# Altium schematic sheet Mosaic.SchDoc: Title of General Schematic Template
size 558 x 426 mm; Date: 10/21/2018; CompanyName: Facebook Inc.; DrawnBy: Xu Li; Engineer: Xu Li; Organization: Facebook Connectivity RF / Hardware; Address1: 1 Hacker Way; Address2: MPK10.02N; Address3: Menlo Park, CA 94025; Address4: USA; DocumentNumber: 0; Revision: 0; SheetNumber: 0
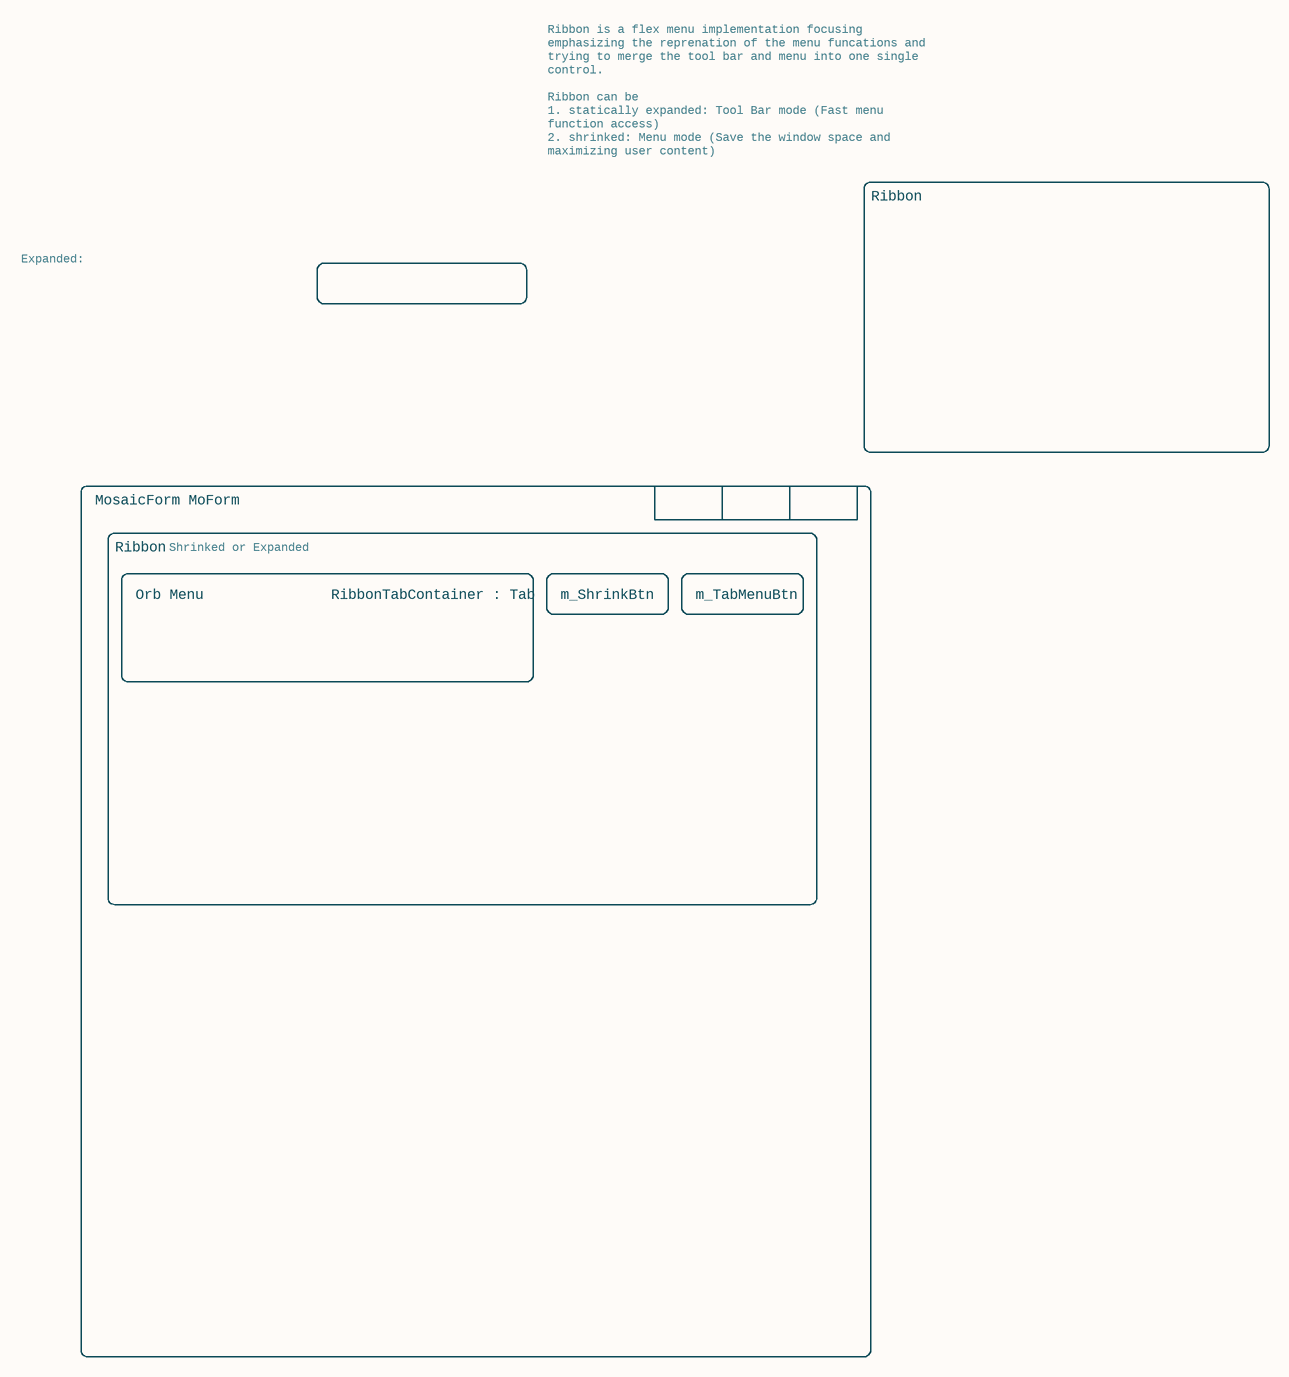
[diagram p0: Mosaic.SchDoc]

## Notes on the sheet
- Ribbon is a flex menu implementation focusing emphasizing the reprenation of the menu funcations and trying to merge the tool bar and menu into one single control.
  Ribbon can be
  1. statically expanded: Tool Bar mode (Fast menu function access)
  2. shrinked: Menu mode (Save the window space and maximizing user content)
- Ribbon
- Expanded:
- MosaicForm MoForm
- Shrinked or Expanded
- Orb Menu
- RibbonTabContainer : Tab
- m_ShrinkBtn
- m_TabMenuBtn